# EAGLE design acadam_2 (EAGLE 6.0)
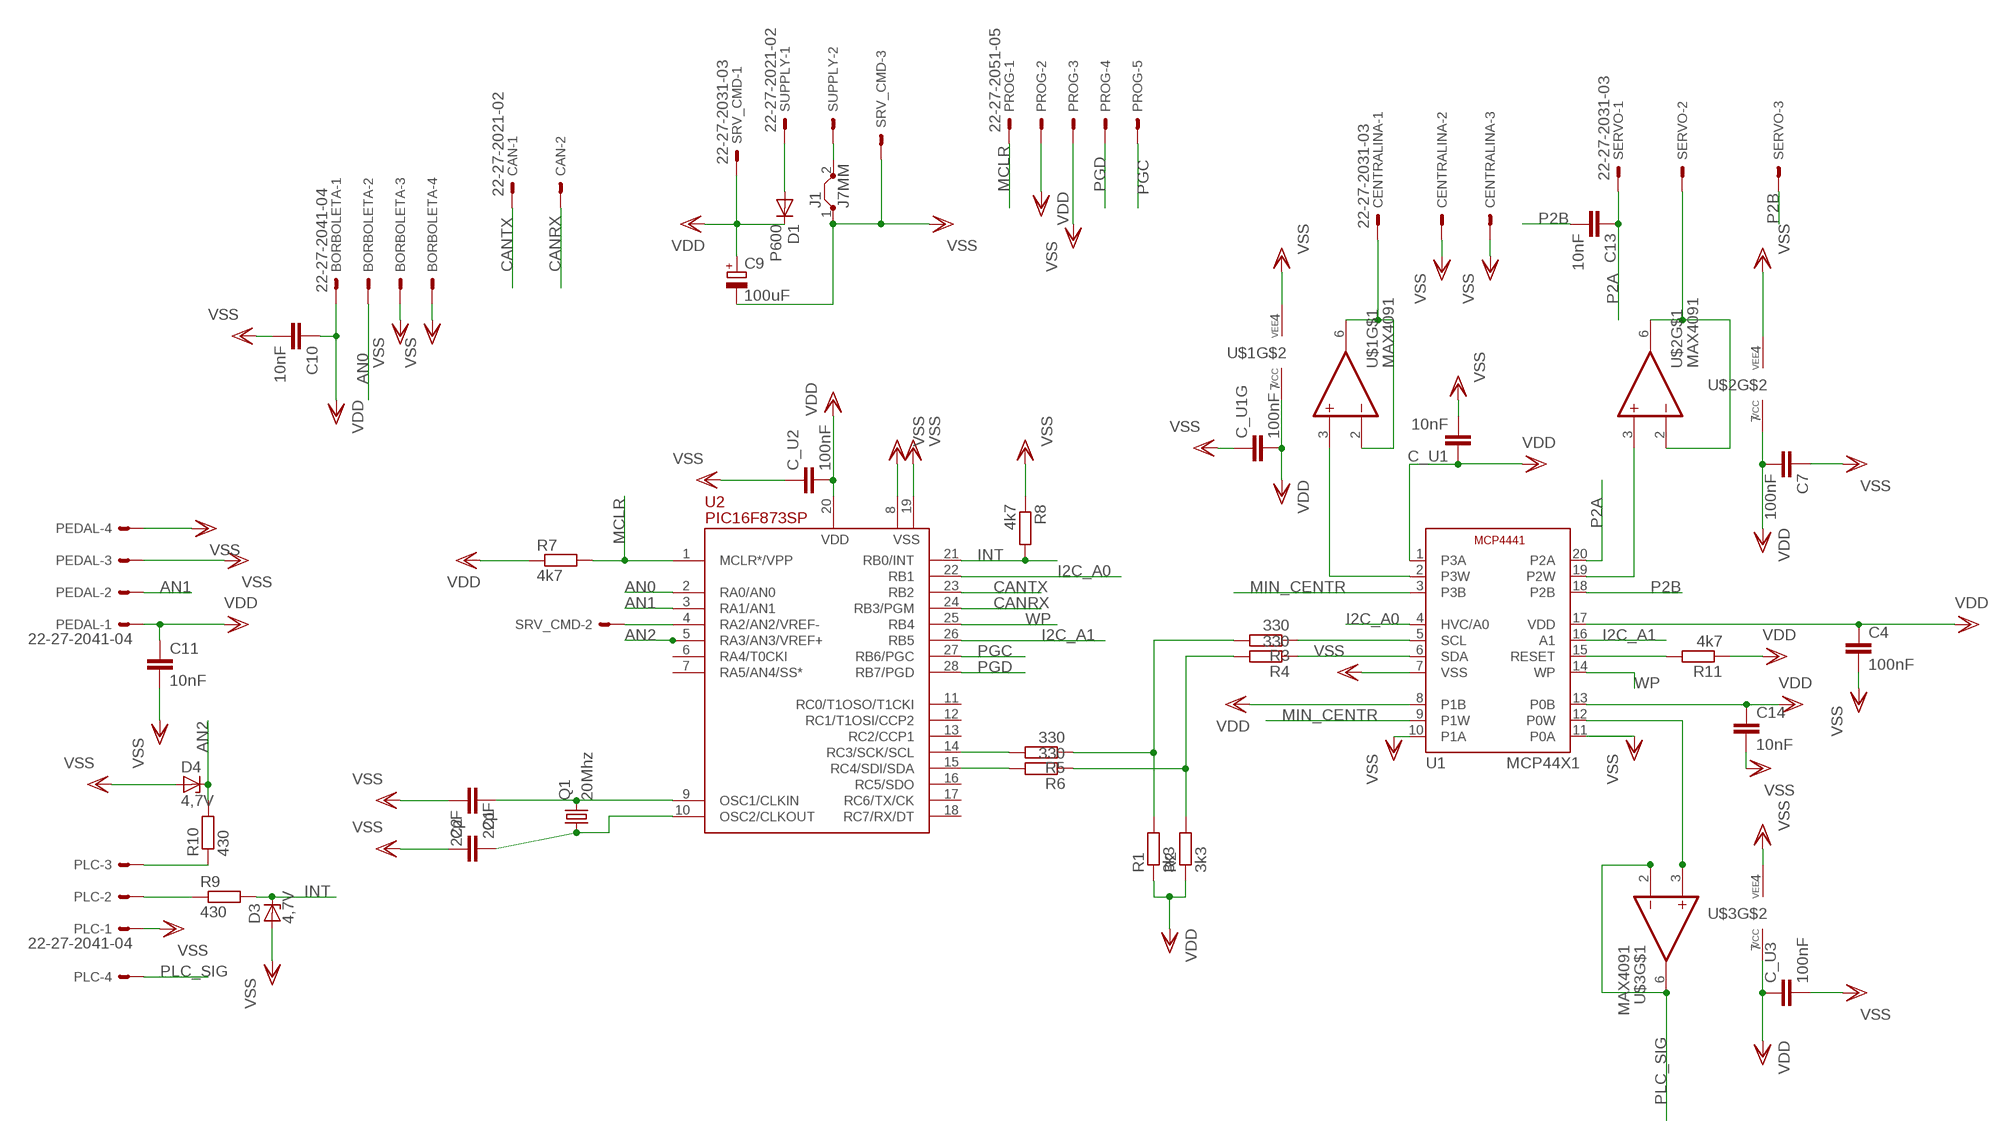
[diagram p0: schematic, sheet 1]

## Parts
BORBOLETA  22-27-2041-04  [6410-04]
C1  22pF  C-EUC0603  [C0603]
C2  22pF  C-EUC0603  [C0603]
C4  100nF  C-EUC0805  [C0805]
C7  100nF  C-EUC0805  [C0805]
C9  100uF  CPOL-EUE2.5-5  [E2,5-5]
C10  10nF  C-EUC0805  [C0805]
C11  10nF  C-EUC0805  [C0805]
C13  10nF  C-EUC0805  [C0805]
C14  10nF  C-EUC0805  [C0805]
C_U1  10nF  C-EUC0805  [C0805]
C_U1G  100nF  C-EUC0805  [C0805]
C_U2  100nF  C-EUC0805  [C0805]
C_U3  100nF  C-EUC0805  [C0805]
CAN  22-27-2021-02  [6410-02]
CENTRALINA  22-27-2031-03  [6410-03]
D1  P600  [P6-15]
D3  4,7V  ZENER-DIODEDO34-7  [DO34Z7]
D4  4,7V  ZENER-DIODEDO34-7  [DO34Z7]
J1  J7MM  [07]
PEDAL  22-27-2041-04  [6410-04]
PLC  22-27-2041-04  [6410-04]
PROG  22-27-2051-05  [6410-05]
Q1  20Mhz  CRYSTALHC49S  [HC49/S]
R1  3k3  R-EU_0204/5  [0204/5]
R2  3k3  R-EU_0204/5  [0204/5]
R3  330  R-EU_0204/5  [0204/5]
R4  330  R-EU_0204/5  [0204/5]
R5  330  R-EU_0204/5  [0204/5]
R6  330  R-EU_0204/5  [0204/5]
R7  4k7  R-EU_0204/5  [0204/5]
R8  4k7  R-EU_0204/5  [0204/5]
R9  430  R-EU_0204/5  [0204/5]
R10  430  R-EU_0204/5  [0204/5]
R11  4k7  R-EU_0204/5  [0204/5]
SERVO  22-27-2031-03  [6410-03]
SRV_CMD  22-27-2031-03  [6410-03]
SUPPLY  22-27-2021-02  [6410-02]
U1  MCP44X1  [TSSOP20]
U2  PIC16F873SP  [DIL28-3]
U$1  MAX4091  [SO-08]
U$2  MAX4091  [SO-08]
U$3  MAX4091  [SO-08]

## Nets
AN0: BORBOLETA.2 U2.2(RA0/AN0)
AN1: PEDAL.2 U2.3(RA1/AN1)
AN2: D4.C R10.2 U2.5(RA3/AN3/VREF+)
CANRX: CAN.2 U2.24(RB3/PGM)
CANTX: CAN.1 U2.23(RB2)
I2C_A0: U1.4(HVC/A0) U2.22(RB1)
I2C_A1: U1.16(A1) U2.26(RB5)
INT: D3.C R8.2 R9.2 U2.21(RB0/INT)
MCLR: PROG.1 R7.2 U2.1(MCLR*/VPP)
MIN_CENTR: U1.3(P3B) U1.9(P1W)
N$1: D1.A SUPPLY.1
N$2: J1.2 SUPPLY.2
N$3: U1.19(P2W) U$2.3(+IN)
N$4: SERVO.2 U$2.2(-IN) U$2.6(OUT)
N$5: U1.2(P3W) U$1.3(+IN)
N$6: CENTRALINA.1 U$1.2(-IN) U$1.6(OUT)
N$7: U1.12(P0W) U$3.3(+IN)
N$8: SRV_CMD.2 U2.4(RA2/AN2/VREF-)
N$9: R1.2 R3.2 R5.1
N$10: R2.2 R4.2 R6.1
N$11: C1.1 Q1.2 U2.9(OSC1/CLKIN)
N$12: R3.1 U1.5(SCL)
N$13: R4.1 U1.6(SDA)
N$14: R6.2 U2.15(RC4/SDI/SDA)
N$15: R5.2 U2.14(RC3/SCK/SCL)
N$16: C2.2 Q1.1 U2.10(OSC2/CLKOUT)
N$18: R11.2 U1.15(RESET)
P2A: C13.1 SERVO.1 U1.20(P2A)
P2B: C13.2 SERVO.3 U1.18(P2B)
PGC: PROG.5 U2.27(RB6/PGC)
PGD: PROG.4 U2.28(RB7/PGD)
PLC_A_M: PLC.2 R9.1
PLC_REF: PLC.3 R10.1
PLC_SIG: PLC.4 U$3.2(-IN) U$3.6(OUT)
VDD: BORBOLETA.1 C4.1 C7.2 C9.+ C10.1 C11.1 C14.1 C_U1.1 C_U1G.2 C_U2.2 C_U3.1 D1.C PEDAL.1 PROG.2 R1.1 R2.1 R7.1 R11.1 SRV_CMD.1 U1.1(P3A) U1.8(P1B) U1.13(P0B) U1.17(VDD) U2.20(VDD) U$1.7(VCC) U$2.7(VCC) U$3.7(VCC)
VSS: BORBOLETA.3 BORBOLETA.4 C1.2 C2.1 C4.2 C7.1 C9.- C10.2 C11.2 C14.2 C_U1.2 C_U1G.1 C_U2.1 C_U3.2 CENTRALINA.2 CENTRALINA.3 D3.A D4.A J1.1 PEDAL.3 PEDAL.4 PLC.1 PROG.3 R8.1 SRV_CMD.3 U1.7(VSS) U1.10(P1A) U1.11(P0A) U2.8(VSS) U2.19(VSS) U$1.4(VEE) U$2.4(VEE) U$3.4(VEE)
WP: U1.14(WP) U2.25(RB4)
Unconnected: U2.6(RA4/T0CKI) U2.7(RA5/AN4/SS*) U2.11(RC0/T1OSO/T1CKI) U2.12(RC1/T1OSI/CCP2) U2.13(RC2/CCP1) U2.16(RC5/SDO) U2.17(RC6/TX/CK) U2.18(RC7/RX/DT)

## Library data of the parts
BORBOLETA PEDAL PLC = con-molex:22-?-04: CONNECTOR wire to board 2.54 mm (.1 inch) pitch header
C1 C2 C4 C7 C10 C11 C13 C14 C_U1 C_U1G C_U2 C_U3 = rcl:C-EU: CAPACITOR, European symbol
C9 = rcl:CPOL-EU: POLARIZED CAPACITOR, European symbol
CAN SUPPLY = con-molex:22-?-02: CONNECTOR wire to board 2.54 mm (.1 inch) pitch header
CENTRALINA SERVO SRV_CMD = con-molex:22-?-03: CONNECTOR wire to board 2.54 mm (.1 inch) pitch header
D1 = diode:P600: DIODE high voltage diode, silicon rectifier 1.0 A to 6.0 A, 50 V to 1300 V http://www.kosemi.com/product/diosr.html
D3 D4 = diode:ZENER-DIODE: Z-Diode
J1 = jumper:J: Bridge
PROG = con-molex:22-?-05: CONNECTOR wire to board 2.54 mm (.1 inch) pitch header
Q1 = crystal:CRYSTAL: CRYSTAL
R1-R11 = rcl:R-EU_: RESISTOR, European symbol
U1 = microchip_my:MCP44X1
U2 = pic16f87x:PIC16F873: FLASH MICROCONTROLLER
U$1-U$3 = maxim_dg:MAX4091

## Board
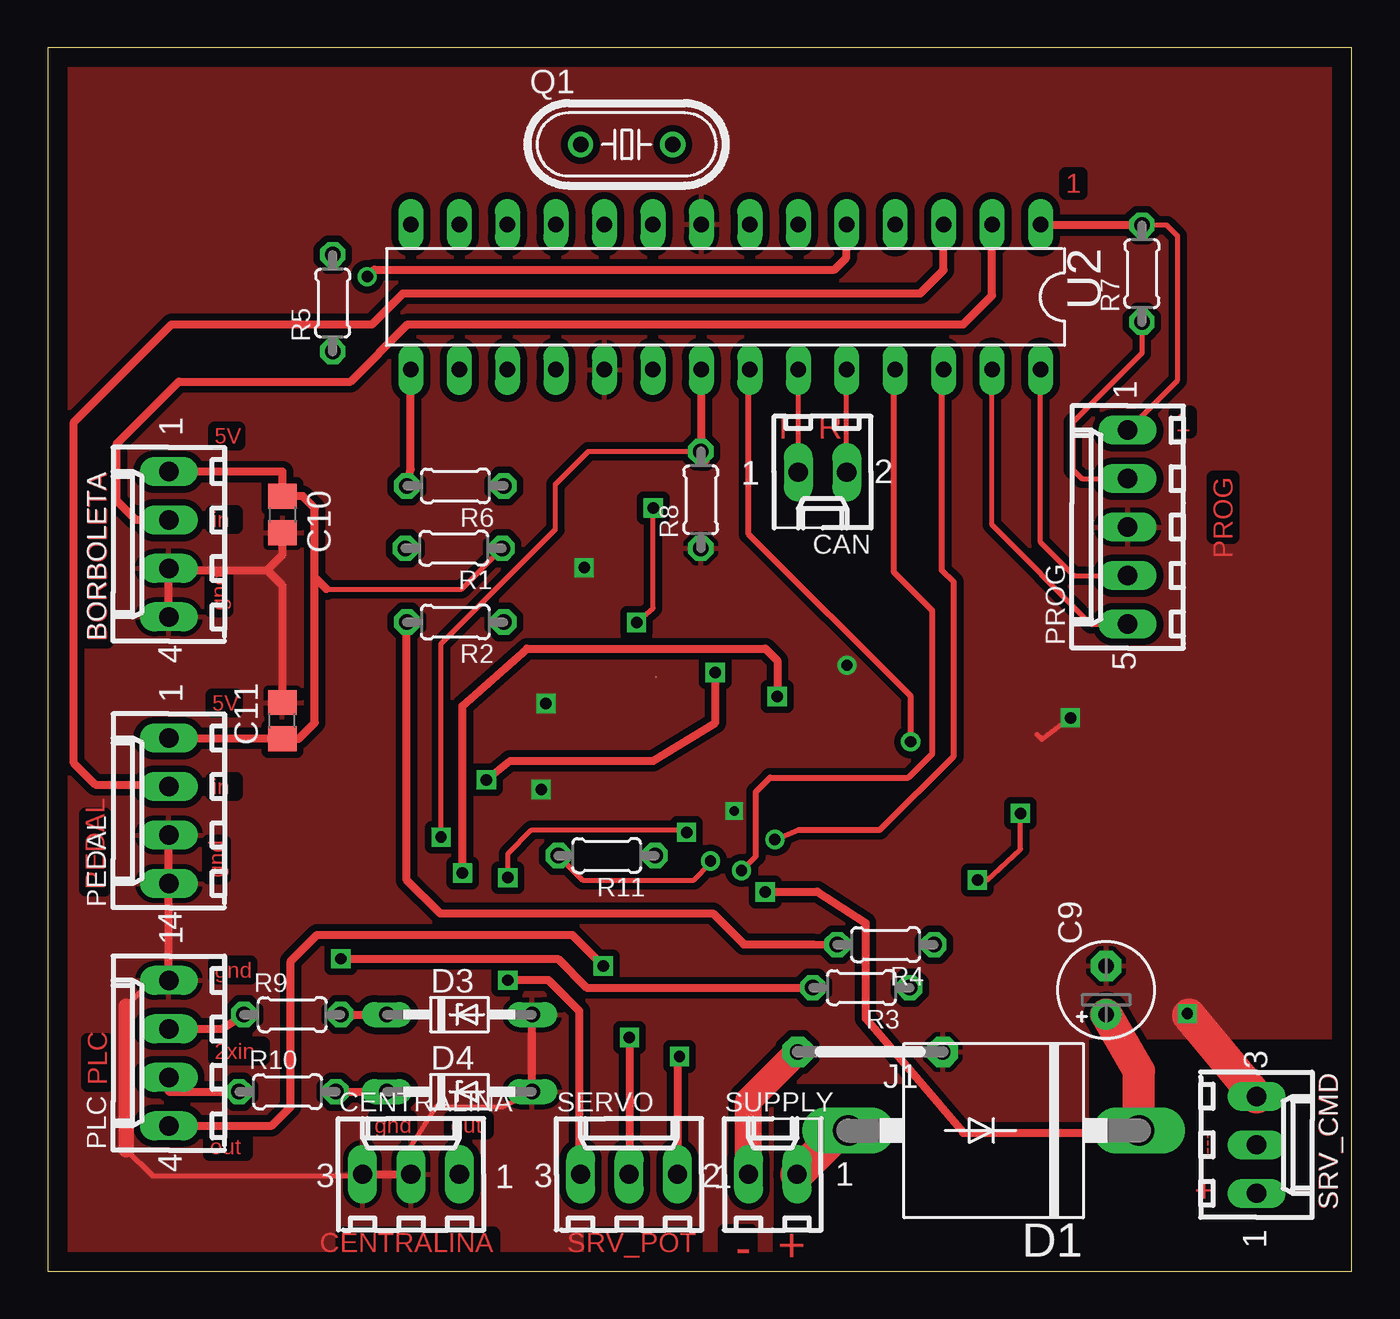
[diagram p1: board, top side]
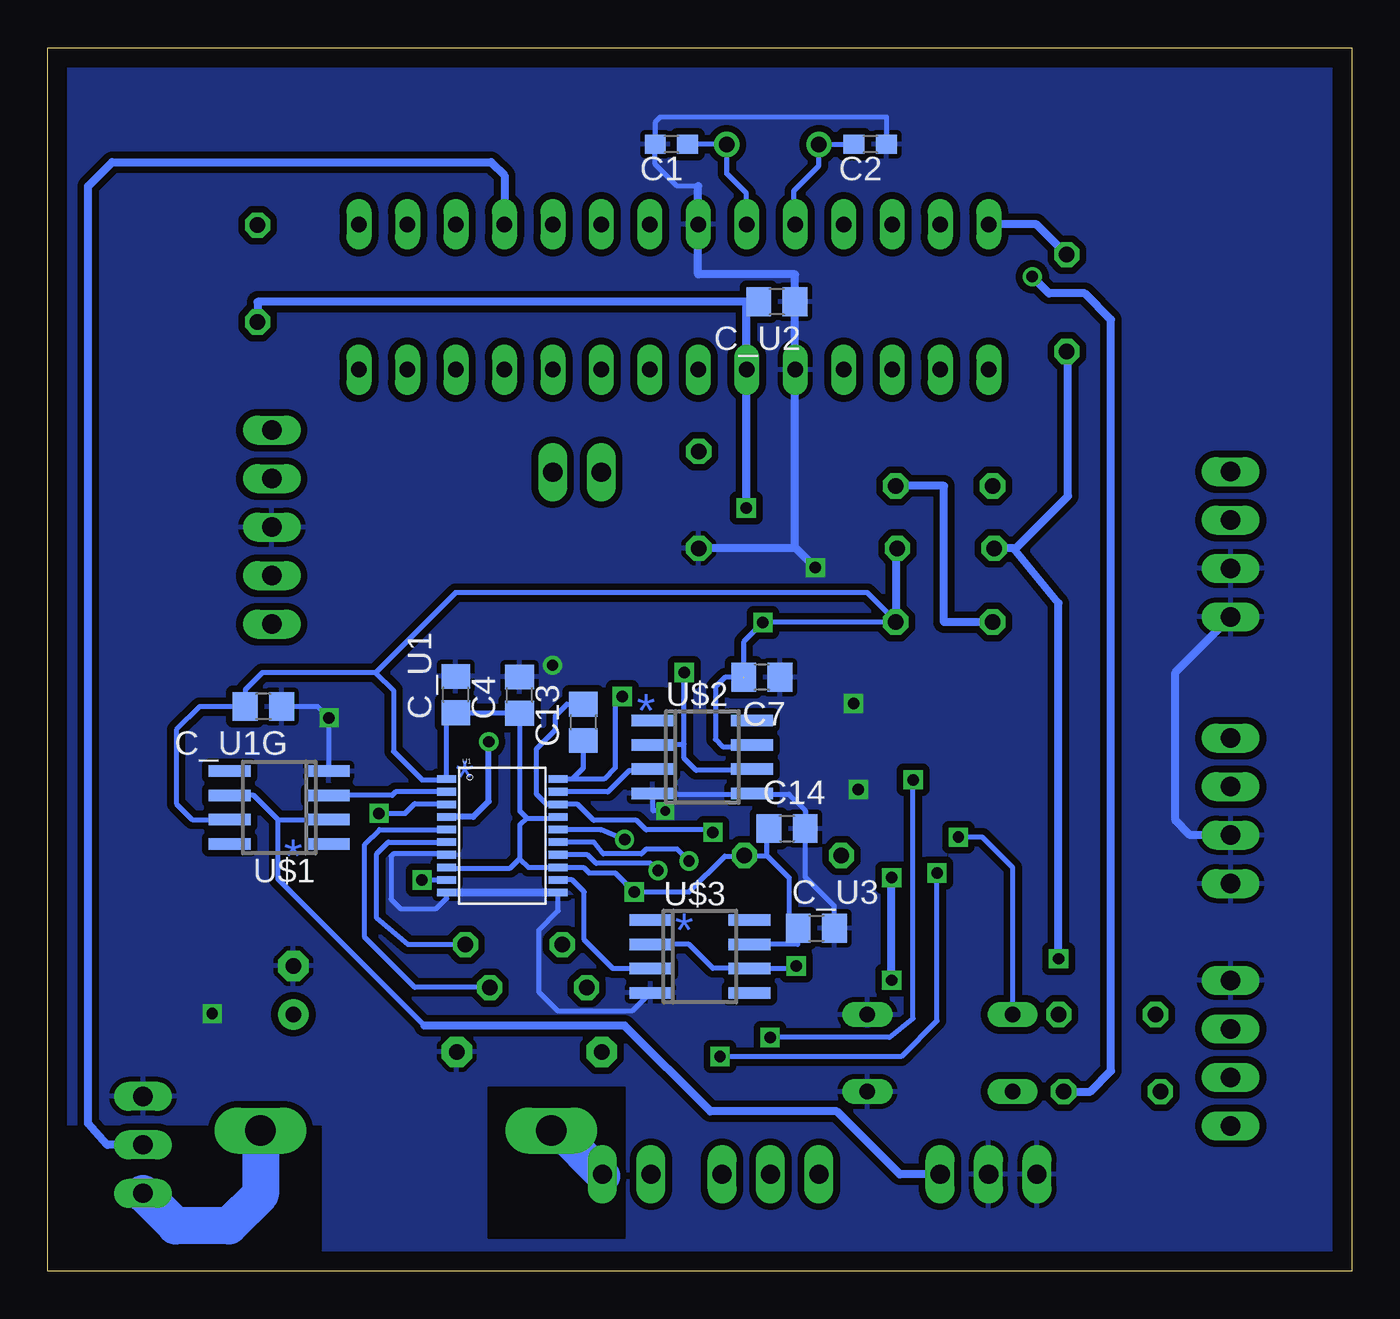
[diagram p2: board, bottom side, seen from below]

Size 68.38 x 64.12 mm. Coordinates in mm from the lower left corner, seen from the top.
Outline: 0,0 68.38,0 68.38,64.12 0,64.12 0,0
Copper layers (1*16): Top 0.035mm / dielectric 1.5mm / Bottom 0.035mm
Design rules: minimum track width 10mil, minimum drill 23mil, track to track 14mil, track to pad 14mil, pad to pad 14mil, via to via 14mil, smd to smd 0mil, copper to edge 40mil, drill to drill 12mil, minimum pad ring 10mil, minimum via ring 8mil, stop-mask expansion 4mil, vias tented up to drill 0mil, thermal gap 10mil
tRestrict: area 54.6,0 to 67.9,12.1; 4 lines
bRestrict: area 54,-1.5 to 68.4,7.6; 4 lines

### Footprints (pad centres in the part's own frame; a part is rotated, then mirrored left to right if it is on the bottom)
6410-04 = drill 1.016 long: 1 3.81,0; 2 1.27,0; 3 -1.27,0; 4 -3.81,0
C0603 = smd 1.1 x 1: 1 -0.85,0; 2 0.85,0
C0805 = smd 1.3 x 1.5: 1 -0.95,0; 2 0.95,0
E2,5-5 = drill 0.813 pad 1.6: + -1.27,0 | drill 0.813 pad 1.6 octagon: - 1.27,0
6410-02 = drill 1.016 long: 1 1.27,0; 2 -1.27,0
6410-03 = drill 1.016 long: 1 2.54,0; 2 0,0; 3 -2.54,0
P6-15 = drill 1.6 long: A 7.62,0; C -7.62,0
DO34Z7 = drill 0.813 long: A 3.81,0; C -3.81,0
07 = drill 0.813 pad 1.6 octagon: 1 -3.81,0; 2 3.81,0
6410-05 = drill 1.016 long: 1 5.08,0; 2 2.54,0; 3 0,0; 4 -2.54,0; 5 -5.08,0
HC49/S = drill 0.813: 1 -2.413,0; 2 2.413,0
0204/5 = drill 0.813 octagon: 1 -2.54,0; 2 2.54,0
TSSOP20 = smd 1 x 0.4: 1 -2.937,2.693; 2 -2.937,2.032; 3 -2.937,1.372; 4 -2.937,0.712; 5 -2.937,0.051; 6 -2.937,-0.609; 7 -2.937,-1.27; 8 -2.943,-1.93; 9 -2.937,-2.59; 10 -2.937,-3.251; 11 2.905,-3.251; 12 2.905,-2.59; 13 2.911,-1.93; 14 2.905,-1.27; 15 2.905,-0.609; 16 2.905,0.051; 17 2.905,0.712; 18 2.905,1.372; 19 2.905,2.032; 20 2.905,2.693
DIL28-3 = drill 0.813 long: 1 -16.51,-3.81; 2 -13.97,-3.81; 3 -11.43,-3.81; 4 -8.89,-3.81; 5 -6.35,-3.81; 6 -3.81,-3.81; 7 -1.27,-3.81; 8 1.27,-3.81; 9 3.81,-3.81; 10 6.35,-3.81; 11 8.89,-3.81; 12 11.43,-3.81; 13 13.97,-3.81; 14 16.51,-3.81; 15 16.51,3.81; 16 13.97,3.81; 17 11.43,3.81; 18 8.89,3.81; 19 6.35,3.81; 20 3.81,3.81; 21 1.27,3.81; 22 -1.27,3.81; 23 -3.81,3.81; 24 -6.35,3.81; 25 -8.89,3.81; 26 -11.43,3.81; 27 -13.97,3.81; 28 -16.51,3.81
SO-08 = smd 0.6 x 2.2: 1 -1.905,-2.6; 2 -0.635,-2.6; 3 0.635,-2.6; 4 1.905,-2.6; 5 1.905,2.6; 6 0.635,2.6; 7 -0.635,2.6; 8 -1.905,2.6

### Placement (x,y rotation side)
BORBOLETA  6.35,38.1 90 top
C1  35.67,59.07 180 bottom
C2  25.25,59.07 180 bottom
C4  43.63,30.2 90 bottom
C7  30.93,31.13 180 bottom
C9  55.49,14.73 90 top
C10  12.31,39.66 270 top
C11  12.3,28.86 90 top
C13  40.28,28.77 90 bottom
C14  29.61,23.2 0 bottom
C_U1  46.98,30.22 90 bottom
C_U1G  57.06,29.59 180 bottom
C_U2  30.14,50.81 180 bottom
C_U3  28.08,17.98 0 bottom
CAN  40.62,41.88 180 top
CENTRALINA  19.05,5.08 0 top
D1  49.59,7.37 180 top
D3  21.59,13.45 0 top
D4  21.59,9.41 0 top
J1  43.12,11.5 180 top
PEDAL  6.35,24.13 90 top
PLC  6.35,11.43 90 top
PROG  56.62,39 90 top
Q1  30.36,59.05 0 top
R1  21.29,37.89 180 top
R2  21.37,34.02 180 top
R3  42.66,14.86 180 top
R4  43.93,17.11 180 top
R5  14.95,50.74 90 top
R6  21.38,41.16 180 top
R7  57.37,52.28 90 top
R8  34.24,40.43 90 top
R9  12.82,13.45 0 top
R10  12.57,9.41 0 top
R11  29.3,21.79 180 top
SERVO  30.48,5.08 0 top
SRV_CMD  63.38,6.62 270 top
SUPPLY  38.02,5.08 0 top
U1  44.52,23.09 0 bottom
U2  35.54,51.06 180 top
U$1  56.23,24.3 90 bottom
U$2  34.05,26.95 270 bottom
U$3  34.18,16.5 270 bottom

### Tracks (layer width: path | path; a pad name or v marks a point on that pad's centre or on a via)
AN0
  Top 0.406: U2.2 49.51,51.13 48,49.62 18.88,49.62 15.88,46.62 6.88,46.62 3.62,43.38 3.62,40.38 4.62,39.38 BORBOLETA.2
AN1
  Top 0.406: U2.3 46.97,52.47 45.75,51.25 18.62,51.25 17,49.62 6.5,49.62 1.38,44.5 1.38,26.62 2.5,25.5 6.25,25.5 PEDAL.2
AN2  (via drill 0.6)
  Top 0.406: R10.2 D4.C | v16.75,52.12 17.12,52.5 41.25,52.5 41.88,53.12 41.88,54.85 U2.5
  Bottom 0.406: R10.2 13.71,9.41 12.62,10.5 12.62,49.88 14,51.25 15.88,51.25 v16.75,52.12
CANRX
  Top 0.254: U2.24 CAN.2
CANTX
  Top 0.254: U2.23 CAN.1
I2C_A0  (via drill 0.6)
  Top 0.305: v45.25,27.75 45.25,30.12 36.75,38.62 36.75,47.19 U2.22
  Bottom 0.305: U1.4 46.07,23.81 45.25,24.62 v45.25,27.75
I2C_A1  (via drill 0.6)
  Top 0.254: v38.12,22.62 39.38,23.12
  Top 0.305: 39.38,23.12 43.62,23.12 47.5,27 47.5,36.12 46.88,36.75 46.88,47.16 U2.26
  Bottom 0.254: 39.38,23.12 v38.12,22.62 39.35,23.15 U1.16
INT  (via drill 0.6)
  Top 0.254: v20.62,22.75 20.62,32.88 26.62,38.88 26.62,41.25 28.34,42.97 R8.2 34.29,43.18 34.27,43.18
  Top 0.406: U2.21 34.27,43.18 34.27,42.5 34.5,42.5 | R9.2 D3.C
  Bottom 0.254: v20.62,22.75 19.38,22.75 17.78,21.16 D3.C
MCLR
  Top 0.254: R7.2 58.67,54.83 59.25,54.25 59.25,46.7 PROG.1
  Top 0.406: U2.1 52.05,54.83 R7.2
MIN_CENTR  (via drill 0.6)
  Top 0.254: v48.75,20.5 49.25,20.5 51,22.12 v51,24
  Bottom 0.254: U1.9 v48.75,20.5 | v51,24 49.62,24 49.12,24.5 47.46,24.5 | 47.38,24.5 47.46,24.5 | 47.46,24.5 U1.3
  Bottom 0.406: U1.9
N$1
  Top 1.778: SUPPLY.1 41.58,7.37 D1.A
  Bottom 1.778: D1.A 41.6,7.38 39.25,5
N$2
  Top 0.406: 36.75,8.88 36.75,8.94
  Top 1.422: SUPPLY.2 36.75,8.88 | 36.75,8.94 J1.2
N$3
  Bottom 0.254: U1.19 39,25.12 37.88,26.25 36.72,26.25 U$2.3
  Bottom 0.406: U1.19
N$4  (via drill 0.6)
  Top 0.406: SERVO.2 30.5,5.08 v30.5,12.25 | v35,31.38 35,28.75 31.75,26.75 24.25,26.75 v23,25.75
  Bottom 0.254: v30.5,12.25 24.25,12.25 23,13.25 v23,25.75 | U$2.6 31.52,26.25 34.38,26.25 35,26.88 35,27.62 | 35,27.62 v35,31.38 | U$2.2 36.62,27.62 35,27.62
N$5
  Bottom 0.254: U1.2 50.12,25.12 50.31,24.94 U$1.3
N$6
  Bottom 0.254: U$1.6 57.56,24.94 56.3,23.67 | 56.3,23.67 U$1.2 | 48.62,12.88 56.3,20.55 56.3,23.67
  Bottom 0.406: CENTRALINA.1 23.7,5.08 27,8.38 33.62,8.38 38.12,12.88 48.62,12.88
N$7
  Bottom 0.254: U$3.3 38.73,15.86 40.25,17.38 40.25,19.88 40.88,20.5 U1.12
N$8
  Bottom 0.406: U2.4 44.43,57.43 45.12,58.12 65,58.12 66.25,56.88 66.25,7.75 65.25,6.62 SRV_CMD.2
N$9  (via drill 0.6)
  Top 0.406: R3.2 28.27,14.86 26.75,16.38 v15.38,16.38
  Bottom 0.406: v15.38,16.38 15.38,35.02 17.75,37.89 | 17.75,37.89 R1.2 | 17.75,37.89 17.61,37.89 14.88,40.62 14.88,48.13 R5.1
N$10
  Top 0.406: R2.2 18.83,20.5 20.58,18.75 34.88,18.75 36.5,17.12 40.13,17.12 R4.2
  Bottom 0.406: R2.2 21.38,34.02 21.38,41.16 R6.1
N$11
  Bottom 0.254: U2.9 31.75,54.89 31.75,56.5 32.77,57.52 Q1.2 34.8,59.05 C1.1
N$12
  Bottom 0.254: U1.5 50.98,23.15 51.75,22.38 51.75,17.5 49.12,14.88 45.34,14.88
  Bottom 0.406: R3.1 45.34,14.88
N$13
  Bottom 0.254: U1.6 50.51,22.49 51.12,21.88 51.12,18.5 49.49,17.11 R4.1
N$14
  Top 0.406: U2.15 19.03,42.03 R6.2
N$15
  Bottom 0.406: U2.14 16.54,54.87 R5.2
N$16
  Bottom 0.254: U2.10 29.25,54.93 29.25,56.62 27.94,57.93 Q1.1 26.11,59.05 C2.2
N$18  (via drill 0.6)
  Top 0.254: v34.75,21.5 34.75,21.38 33.88,20.5 28.05,20.5 R11.2
  Bottom 0.254: U1.15 39.74,22.49 39.25,21.88 37.25,21.88 37,22.12 35.38,22.12 v34.75,21.5
P2A  (via drill 0.6)
  Top 0.406: v21.75,20.88 21.75,29.62 25.12,32.62 37.62,32.62 38.25,32 v38.25,30.12 | v33.12,11.25 33.02,11.12 SERVO.1
  Bottom 0.254: v33.12,11.25 23.62,11.25 21.75,13.12 v21.75,20.88 | 40.88,25.79 39.21,25.79 38.62,26.38 38.62,29.75 v38.25,30.12 | 40.88,25.79 U1.20 | C13.1 40.28,26.38 40.88,25.79
P2B  (via drill 0.6)
  Top 0.254: v24.12,20.62 24.12,21.88 25.38,23.12 33.38,23.12 v33.5,23
  Top 0.406: v24.12,15.25 26.25,15.25 27.88,13.62 27.88,5.14 SERVO.3
  Bottom 0.254: C13.2 41.16,29.72 41.75,29.12 41.75,28.38 42.75,27.38 42.75,25 42.22,24.47 U1.18 40.59,24.47 39.75,23.62 37.5,23.62 37,23.12 33.62,23.12 v33.5,23
  Bottom 0.406: v24.12,15.25 v24.12,20.62
PGC
  Top 0.254: U2.27 49.51,39.12 54.7,33.92 PROG.5
PGD
  Top 0.254: PROG.4 53.79,36.46 52.05,38.2 U2.28
PLC_A_M
  Top 0.406: PLC.2 9.16,12.7 R9.1
PLC_REF
  Top 0.406: PLC.3 6.35,9.41 R10.1
PLC_SIG  (via drill 0.6)
  Top 0.406: PLC.4 11.75,7.62 12.75,8.62 12.75,16.25 14.12,17.62 27.5,17.62 v29.12,16
  Bottom 0.254: 36.65,17 U$3.2 34.75,17.12 33.5,15.88 31.59,15.88 U$3.6 29.27,15.86 v29.12,16
VDD  (via drill 0.6)  (1 unrouted)
  Top 0.254: v31.75,40 31.75,34.75 v30.88,34 | 23.83,37.45 R1.1 21.69,35.75 14.62,35.75 | 12.32,40.62 C10.1 | R7.1 57.37,48.12 53.75,44.5 53.75,42 54.21,41.54 PROG.2
  Top 0.406: BORBOLETA.1 12.31,41.91 C10.1 | v37.62,19.88 37.73,19.9 40.35,19.9 42.88,18.25 42.88,13.25 48,7.25 57.09,7.25 D1.C | 14,36.38 14,28.75 13.15,27.91 C11.1 12.55,27.94 PEDAL.1 | 14,36.38 14,40 13.38,40.62 12.32,40.62 | 14,36.38 14.62,35.75 | C9.+ 55.46,13.5
  Top 1.676: D1.C 57.22,10.49 C9.+
  Bottom 0.254: C7.2 31.89,32.99 v30.88,34 23.93,34 R2.1 24.13,34.29 25.4,35.56 46.99,35.56 51.17,31.38 | 43.62,21.62 43.16,21.16 U1.13 40.29,21.16 40,20.88 38.62,20.88 v37.62,19.88 | 43.62,21.62 43.62,23.38 43.25,23.75 | 43.25,23.75 41.67,23.75 U1.17 | 43.25,23.75 43.62,24.12 43.62,29.23 C4.1 43.63,29.27 C_U1.1 47.46,28.79 U1.1 47.46,25.75 48.75,25.75 50.25,27.25 50.25,30.45 51.17,31.38 | v37.62,19.88 38.1,20.32 | U$3.7 29.06,17.13 C_U3.1 29.5,17.57 29.5,20.62 30.66,21.79 | 30.66,21.79 R11.1 31.88,21.75 32.88,21.75 34.75,19.88 v37.62,19.88 | 30.66,21.79 30.66,23.09 C14.1 | 51.17,31.38 57.12,31.38 58.02,30.48 C_U1G.2 60.41,29.59 61.62,28.38 61.62,24.5 60.8,23.67 U$1.7 | U$2.7 31.54,27.5 | C7.2 32.88,31.12 33.38,30.62 33.38,27.88 33,27.5 31.12,27.5 | U1.8 47.42,21.12 44.12,21.12 43.62,21.62
  Bottom 0.406: 31.73,50.81 U2.20 31.73,40 v31.75,40 | 31.73,50.81 C_U2.2 | R7.1 57.37,50.81 31.73,50.81 | C14.1 30.55,23.07 | R2.1 23.91,37.89 R1.1 | U$2.7 31.12,27.59 31.12,27.5
  Bottom 1.93: SRV_CMD.1 61.66,2.38 58.88,2.38 57.22,4.04 D1.C
VSS  (via drill 0.5, 0.58, 0.6)
  Top 0.254: PLC.1 5.49,15.24 4.12,13.88 | 4.12,6.38 5.5,5 16.5,5 | CENTRALINA.2 19.05,6.55 20.38,8.62 23.88,8.62 25.38,9.38 | 59.84,13.41 v59.75,13.5 | v53.62,29 52.12,27.88 51.88,28.12
  Top 0.406: PEDAL.3 PEDAL.4 PLC.1 | CENTRALINA.3 CENTRALINA.2 | D4.A D3.A | C10.2 12.31,37.56 11.5,36.75 | 6.43,36.75 11.5,36.75 | 6.43,36.75 BORBOLETA.3 | 11.5,36.75 12.3,35.95 C11.2 | 6.43,36.75 6.35,36.67 BORBOLETA.4
  Top 0.813: 4.12,6.38 4.12,13.88
  Top 1.778: SRV_CMD.3 59.84,13.41
  Bottom 0.254: C2.1 24.39,60.5 36.25,60.5 36.5,60.25 36.5,59.09 C1.2 36.52,58.02 35.38,56.88 34.27,56.88 | C_U3.2 27.13,19.13 28.66,20.66 C14.2 28.66,24.16 29.5,25 36.12,25 | U1.11 41.62,18.89 42.62,17.88 42.62,14.62 41.62,13.62 37.74,13.62 U$3.4 | 53.72,26.12 U$1.4 53.63,28.99 v53.62,29 54.22,29.59 C_U1G.1 | U1.7 47.51,21.88 50.25,21.88 50.38,21.75 50.38,19.5 49.88,19 48,19 47.46,19.54 U1.10 | U$2.4 36.5,25.05 | v36,24.12 36.62,24.12 36.62,25 36.5,25
  Bottom 0.406: 34.27,56.88 U2.8 34.27,52.25 29.2,52.25 C_U2.1 U2.19 29.19,37.89 | U1.11 U1.10 | 29.19,37.89 R8.1 | PEDAL.3 8.48,22.86 9.25,23.62 9.25,31.39 BORBOLETA.4 | 29.19,37.89 29.14,37.89 v28.12,36.88
  other vias: 25.88,25.25 26.12,29.75 41.91,31.75
  pour Bottom: 5.62,64.12 68.38,64.12 68.38,10.5 68.38,0 2.12,0 0,0 0,54 0,64.12
  pour Top: -1.38,65 69.5,65 69.5,-1 -1.38,-1
WP  (via drill 0.6)
  Top 0.254: v36.38,21 37.12,21.75
  Top 0.305: 37.12,21.75 37.12,25.12 37.88,25.88 45.12,25.88 46.38,27.12 46.38,34.62 44.38,36.62 44.38,47.2 U2.25
  Bottom 0.254: U1.14 40.08,21.82 39.62,21.38 36.75,21.38 v36.38,21

### Text on the board
Top: 1 | T | R | 1 | 5V | PROG | in | gnd | BORBOLETA | 5V | in | gnd | PEDAL | gnd | 2xin | PLC | SRV_CMD | gnd | out | out | --- | + | CENTRALINA | SRV_POT | - | +
Bottom: * | * | * | *